# EAGLE design PCB_Draft_1 (EAGLE 9.6.2)
AUTHOR: R. Hall, A. Singh, K.Quizon; BOARD_NAME: ESP32 I2C Exp / M Driver; DOC_NUM: 0; PROJECT_NAME: R8-O7 PCB; REVISION: 4
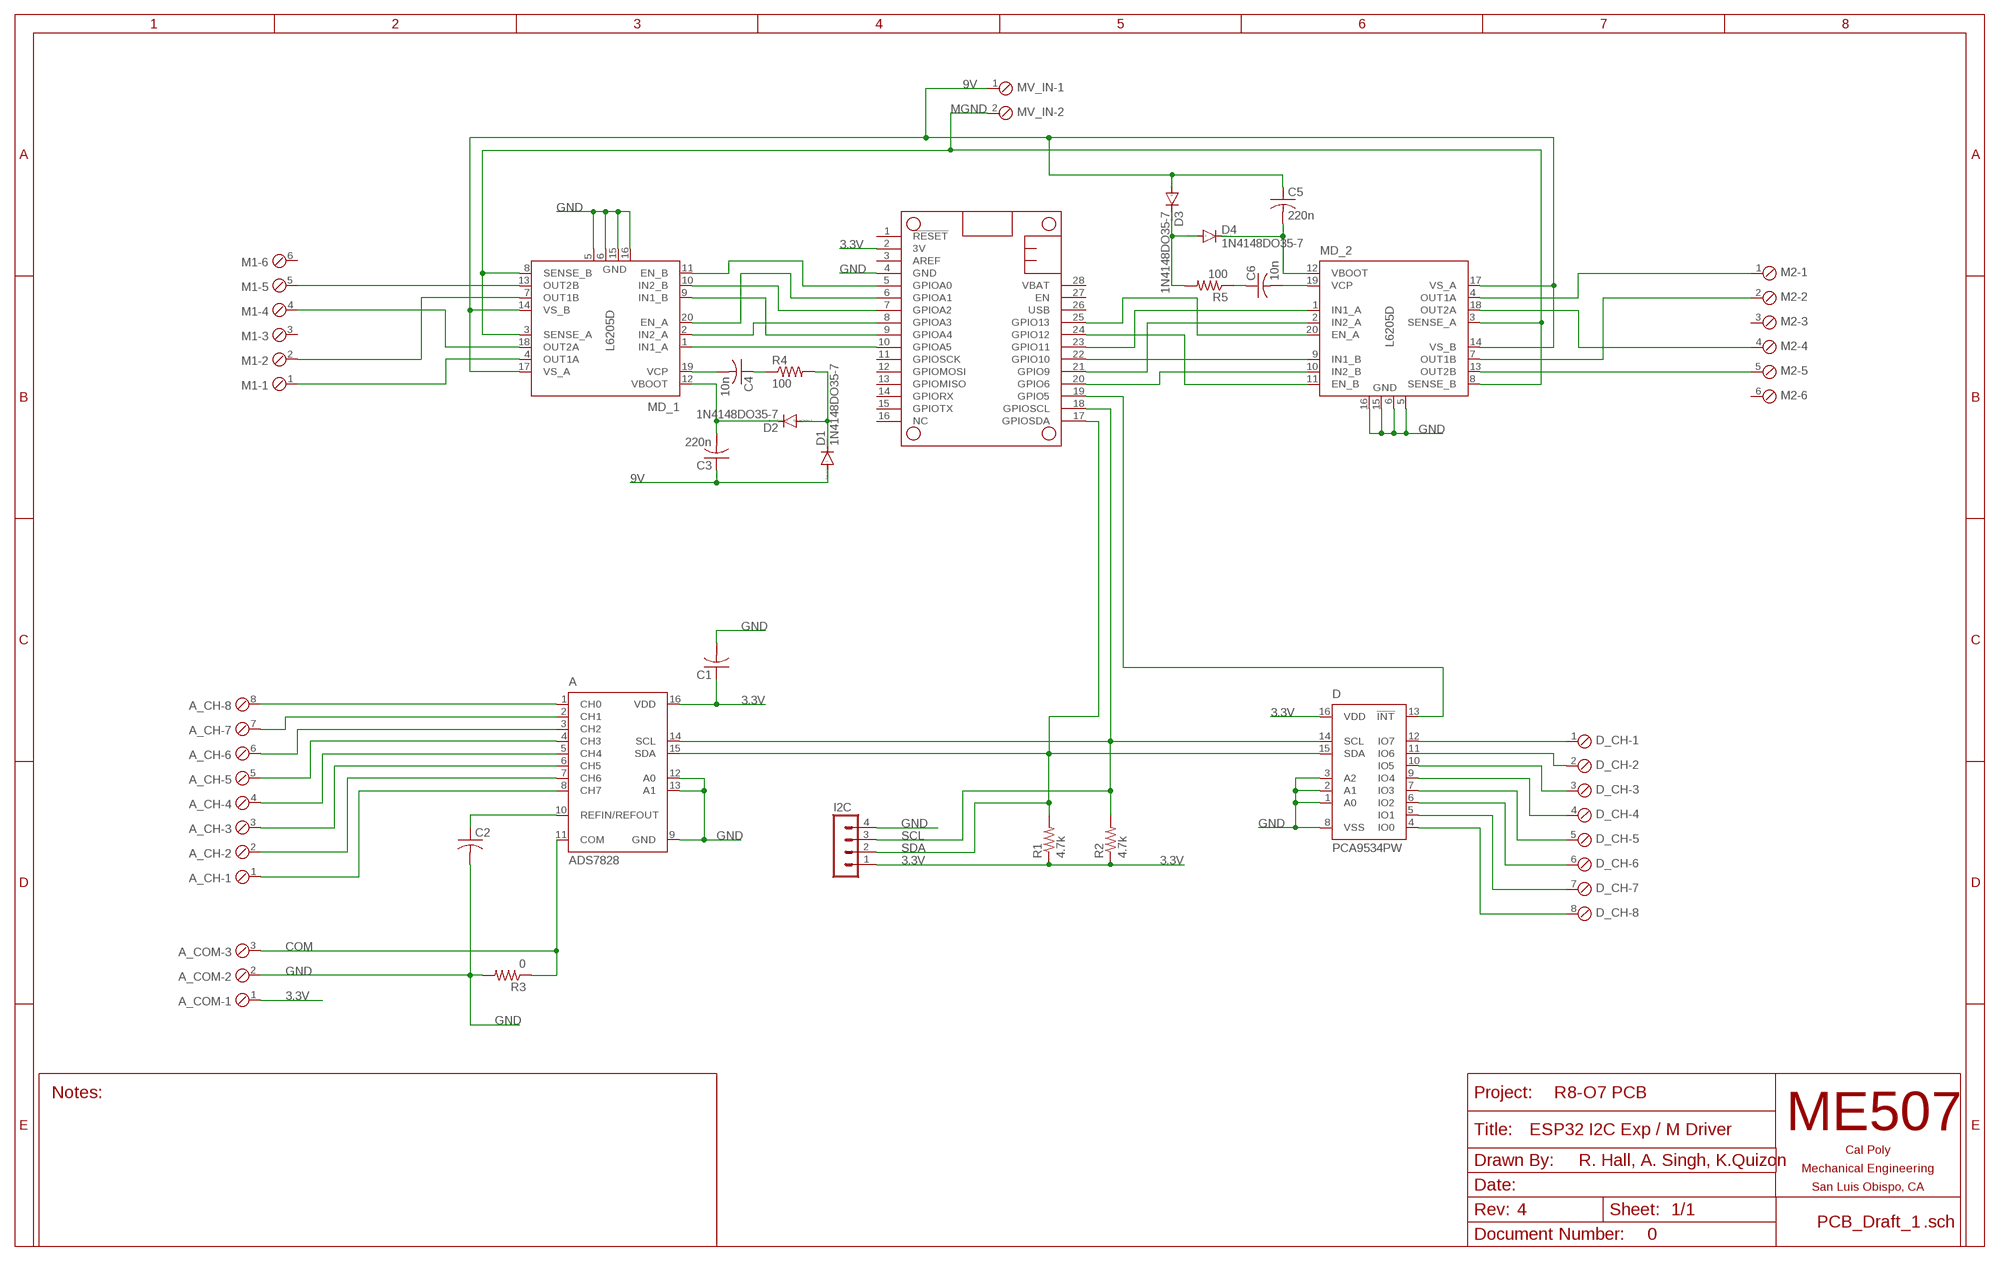
[diagram p0: schematic, sheet 1]

## Parts
A  ADS7828  [TSSOP16-PW]
A_CH  SCREWTERM_8P_254  [8POL254]
A_COM  SCREWTERM_3P_254  [3POL254]
C1  C-USC0805  [C0805]
C2  C-USC0805  [C0805]
C3  220n  C-USC0805  [C0805]
C4  10n  C-USC0805  [C0805]
C5  220n  C-USC0805  [C0805]
C6  10n  C-USC0805  [C0805]
D  PCA9534PW  [TSSOP16]
D1  1N4148DO35-7  [DO35-7]
D2  1N4148DO35-7  [DO35-7]
D3  1N4148DO35-7  [DO35-7]
D4  1N4148DO35-7  [DO35-7]
D_CH  SCREWTERM_8P_254  [8POL254]
FTHRWNG  FEATHERWINGEXTENDED_BOTH_ENDS  [FEATHERWING]
I2C  MA04-1  [MA04-1]
M1  SCREWTERM_6P_254  [6POL254]
M2  SCREWTERM_6P_254  [6POL254]
MD_1  L6205D  [SO20]
MD_2  L6205D  [SO20]
MV_IN  SCREWTERM_2P_254  [2POL254]
R1  4.7k  R-US_M0805  [M0805]
R2  4.7k  R-US_M0805  [M0805]
R3  0  R-US_M0805  [M0805]
R4  100  R-US_M0805  [M0805]
R5  100  R-US_M0805  [M0805]

## Nets
3.3V: A.16(VDD) A_COM.1 C1.1 D.16(VDD) FTHRWNG.2(3V) I2C.1 R1.1 R2.1
9V: C3.1 C5.1 D1.A D3.A MD_1.14(VS_B) MD_1.17(VS_A) MD_2.14(VS_B) MD_2.17(VS_A) MV_IN.1
COM: A.11(COM) A_COM.3 R3.1
GND: A.9(GND) A.12(A0) A.13(A1) A_COM.2 C1.2 C2.2 D.1(A0) D.2(A1) D.3(A2) D.8(VSS) FTHRWNG.4(GND) I2C.4 MD_1.5(GND) MD_1.6(GND) MD_1.15(GND) MD_1.16(GND) MD_2.5(GND) MD_2.6(GND) MD_2.15(GND) MD_2.16(GND) R3.2
MGND: MD_1.3(SENSE_A) MD_1.8(SENSE_B) MD_2.3(SENSE_A) MD_2.8(SENSE_B) MV_IN.2
N$1: D.12(IO7) D_CH.1
N$2: D.11(IO6) D_CH.2
N$3: D.10(IO5) D_CH.3
N$4: D.9(IO4) D_CH.4
N$5: D.7(IO3) D_CH.5
N$6: D.6(IO2) D_CH.6
N$7: D.5(IO1) D_CH.7
N$8: D.4(IO0) D_CH.8
N$9: A.1(CH0) A_CH.8
N$10: A.2(CH1) A_CH.7
N$11: A.3(CH2) A_CH.6
N$12: A.4(CH3) A_CH.5
N$13: A.5(CH4) A_CH.4
N$14: A.6(CH5) A_CH.3
N$15: A.7(CH6) A_CH.2
N$16: A.8(CH7) A_CH.1
N$17: A.10(REFIN/REFOUT) C2.1
N$18: C4.2 MD_1.19(VCP)
N$19: D.13(!INT) FTHRWNG.19(GPIO5)
N$20: M1.1 MD_1.4(OUT1A)
N$21: M1.2 MD_1.7(OUT1B)
N$22: M1.4 MD_1.18(OUT2A)
N$23: M1.5 MD_1.13(OUT2B)
N$24: M2.1 MD_2.4(OUT1A)
N$25: C4.1 R4.1
N$26: M2.2 MD_2.7(OUT1B)
N$27: M2.4 MD_2.18(OUT2A)
N$28: M2.5 MD_2.13(OUT2B)
N$29: FTHRWNG.20(GPIO6) MD_2.10(IN2_B)
N$30: FTHRWNG.22(GPIO10) MD_2.9(IN1_B)
N$31: FTHRWNG.21(GPIO9) MD_2.2(IN2_A)
N$32: FTHRWNG.23(GPIO11) MD_2.1(IN1_A)
N$33: FTHRWNG.10(GPIOA5) MD_1.1(IN1_A)
N$34: FTHRWNG.8(GPIOA3) MD_1.2(IN2_A)
N$35: FTHRWNG.9(GPIOA4) MD_1.9(IN1_B)
N$36: FTHRWNG.7(GPIOA2) MD_1.10(IN2_B)
N$37: FTHRWNG.24(GPIO12) MD_2.11(EN_B)
N$38: FTHRWNG.25(GPIO13) MD_2.20(EN_A)
N$39: FTHRWNG.6(GPIOA1) MD_1.20(EN_A)
N$40: FTHRWNG.5(GPIOA0) MD_1.11(EN_B)
N$41: D1.C D2.A R4.2
N$42: C3.2 D2.C MD_1.12(VBOOT)
N$43: C6.2 MD_2.19(VCP)
N$44: C6.1 R5.1
N$45: D3.C D4.A R5.2
N$46: C5.2 D4.C MD_2.12(VBOOT)
SCL: A.14(SCL) D.14(SCL) FTHRWNG.18(GPIOSCL) I2C.3 R2.2
SDA: A.15(SDA) D.15(SDA) FTHRWNG.17(GPIOSDA) I2C.2 R1.2
Unconnected: FTHRWNG.1(!RESET) FTHRWNG.3(AREF) FTHRWNG.11(GPIOSCK) FTHRWNG.12(GPIOMOSI) FTHRWNG.13(GPIOMISO) FTHRWNG.14(GPIORX) FTHRWNG.15(GPIOTX) FTHRWNG.16(NC) FTHRWNG.26(USB) FTHRWNG.27(EN) FTHRWNG.28(VBAT) M1.3 M1.6 M2.3 M2.6

## Library data of the parts
A = burr-brown:ADS7828: 12-Bit, 8-Channel Sampling ANALOG-TO-DIGITAL CONVERTER with I2C? Interface Source: www.ti.com .. ADS7828.pdf; MF: TEXAS INSTRUMENTS; MPN: ADS7828E/250; OC_FARNELL: 1470338; OC_NEWARK: 74C7158
A_CH D_CH = ME507:SCREWTERM_8P: Screw Terminal Block This part is designed for a screw terminal connector. The 2.54mm (0.100 inch) foorprint can also be used for male or female pin headers such as those on most development boards. One can also solder wires directly into the holes, though this makes modifications or repairs to the system more inconvenient. Larger versions can carry more current.
A_COM = ME507:SCREWTERM_3P: Screw Terminal Block This part is designed for a screw terminal connector. The 2.54mm (0.100 inch) foorprint can also be used for male or female pin headers such as those on most development boards. One can also solder wires directly into the holes, though this makes modifications or repairs to the system more inconvenient. Larger versions can carry more current.
C1-C6 = rcl:C-US: CAPACITOR, American symbol; SPICEPREFIX: C
D = micro-philips:PCA9534: 8-bit I2C-bus and SMBus low power I/O port with interrupt Source: www.nxp.com .. PCA9534_3.pdf; MPN: PCA9534PW; OC_FARNELL: 1408285; OC_NEWARK: 18M7516
D1-D4 = diode:1N4148: DIODE high speed (Philips)
FTHRWNG = ME507:FEATHERWING: AdaFruitTM Feather Wing A modified version of a Featherwing, the add-on board for an AdaFruit(tm) Feather development board. There is a standard size version which is the same size as the Feather board on which the microcontroller hangs out. There is also an extended version, with each and longer by a quarter inch to allow for connectors such as screw terminals which aren't hidden under another board if this wing isn't on the top of the board stack. The pins are named in a generic fashion; these names do not necessarily correspond to Arduino or Python pin numbers. The designer must refer to the pinout diagram for each specific Feather board to find the functions of each pin.
I2C = con-lstb:MA04-1: PIN HEADER; OC_FARNELL: unknown; OC_NEWARK: unknown
M1 M2 = ME507:SCREWTERM_6P: Screw Terminal Block This part is designed for a screw terminal connector. The 2.54mm (0.100 inch) foorprint can also be used for male or female pin headers such as those on most development boards. One can also solder wires directly into the holes, though this makes modifications or repairs to the system more inconvenient. Larger versions can carry more current.
MD_1 MD_2 = st-microelectronics:L6205: DUAL DMOS FULL BRIDGE MOTOR DRIVER; MPN: L6205D; OC_FARNELL: unknown; OC_NEWARK: 37M3487
MV_IN = ME507:SCREWTERM_2P: Screw Terminal Block This part is designed for a screw terminal connector. The 2.54mm (0.100 inch) foorprint can also be used for male or female pin headers such as those on most development boards. One can also solder wires directly into the holes, though this makes modifications or repairs to the system more inconvenient. Larger versions can carry more current.
R1-R5 = rcl:R-US_: RESISTOR, American symbol; SPICEPREFIX: R

## Board
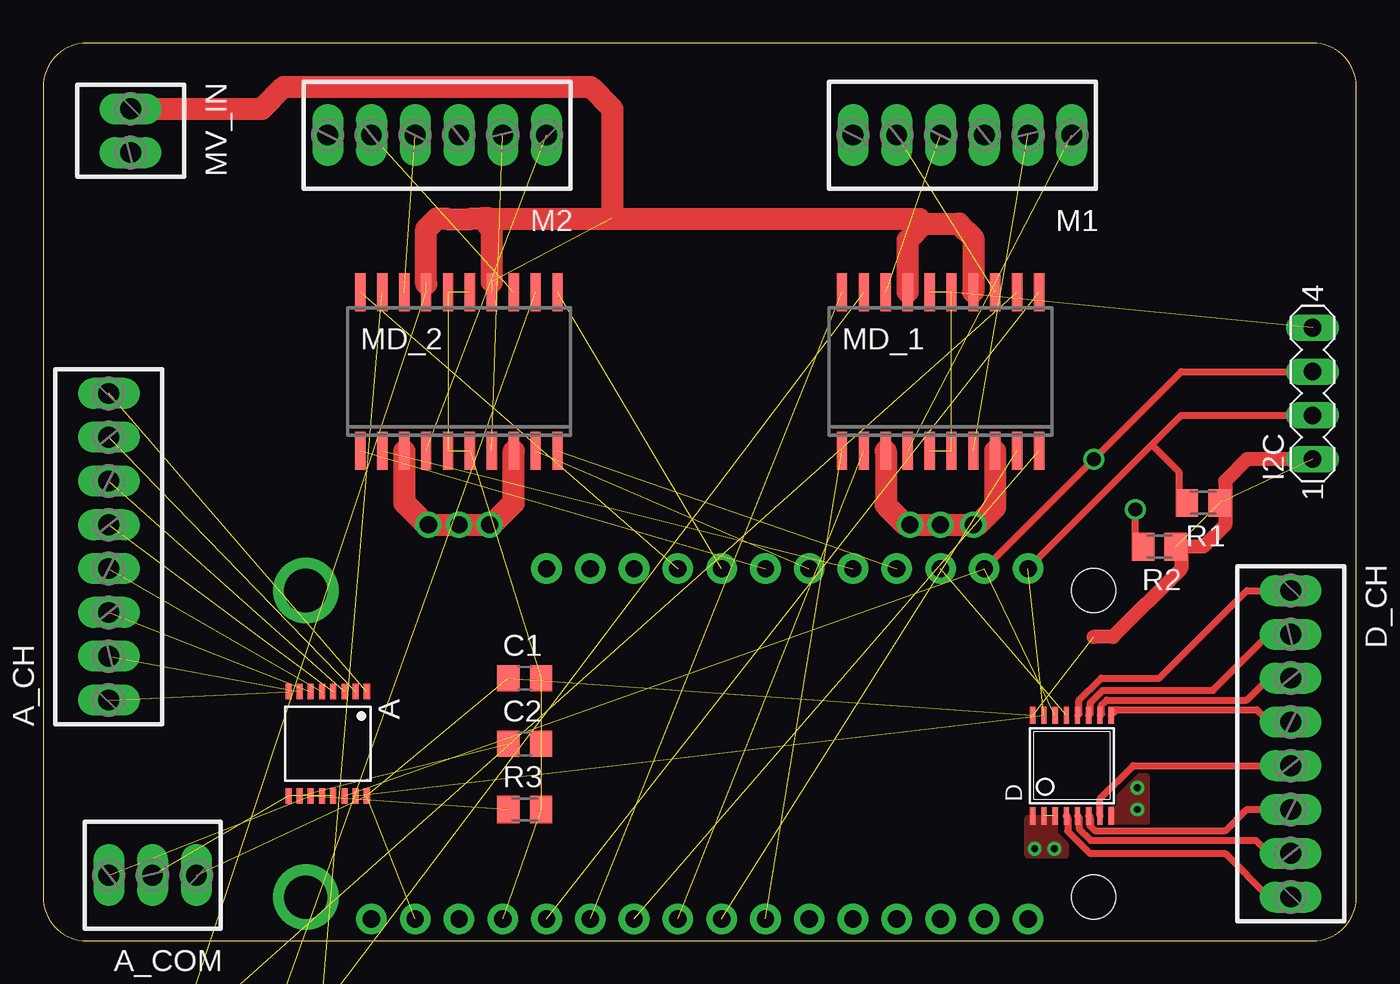
[diagram p1: board, top side]
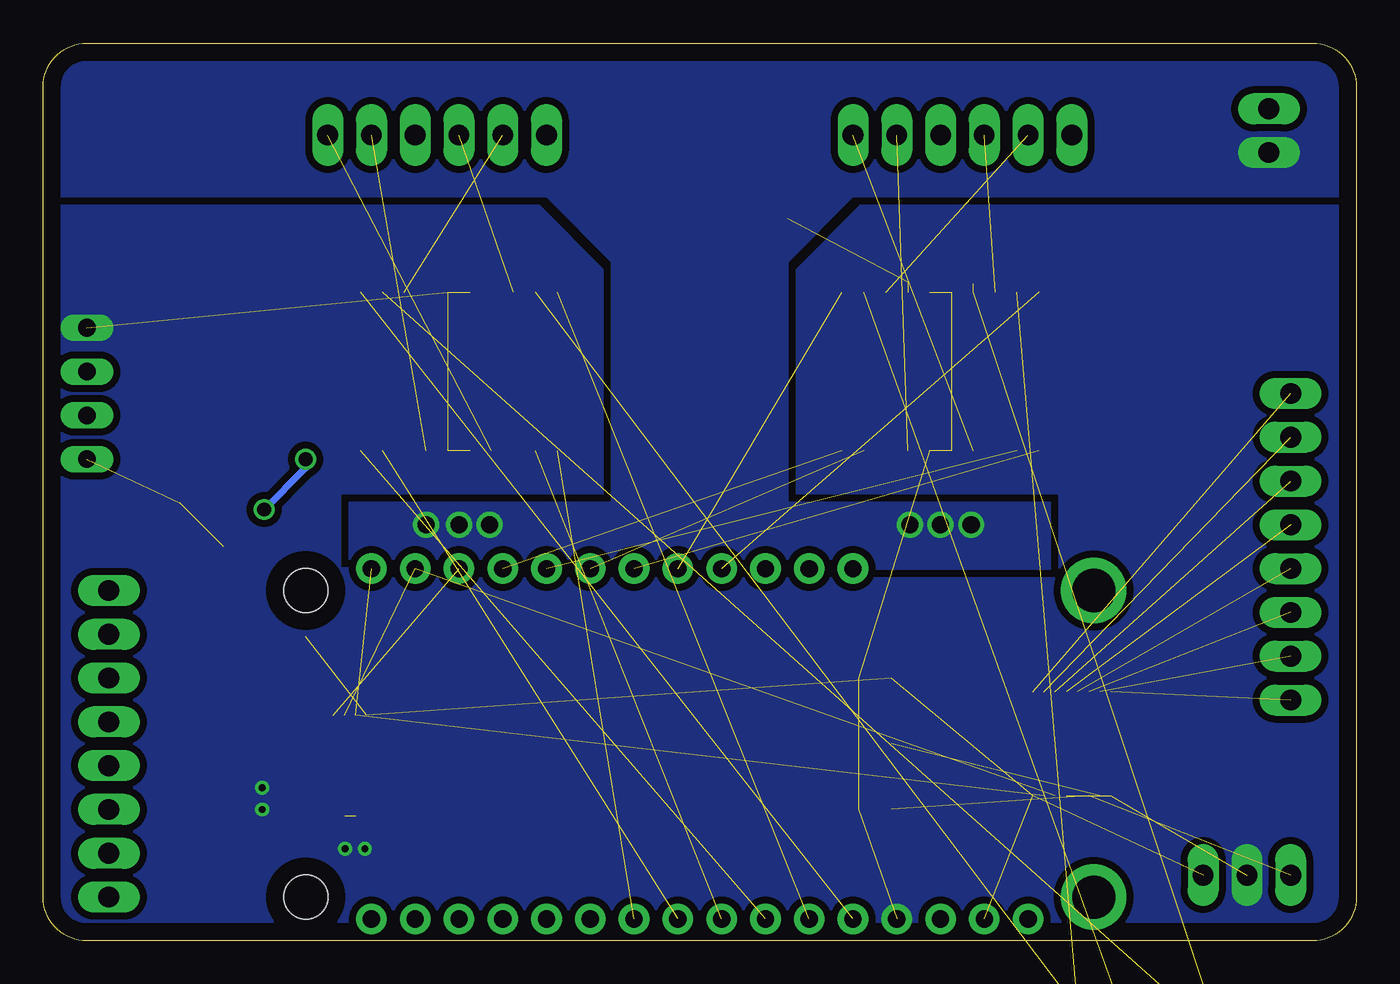
[diagram p2: board, bottom side, seen from below]

Size 76.2 x 52.07 mm. Coordinates in mm from the lower left corner, seen from the top.
Copper layers (1*16): Top 0.035mm / dielectric 1.5mm / Bottom 0.035mm
Design rules "default": minimum track width 6mil, minimum drill 0.35mm, track to track 6mil, track to pad 6mil, pad to pad 6mil, via to via 6mil, smd to smd 6mil, copper to edge 40mil, drill to drill 6mil, minimum pad ring 10mil, minimum via ring 8mil, stop-mask expansion 4mil, vias tented up to drill 0mil, thermal gap 10mil

### Footprints (pad centres in the part's own frame; a part is rotated, then mirrored left to right if it is on the bottom)
TSSOP16-PW = smd 0.35 x 0.9: 1 -2.275,-3.025; 2 -1.625,-3.025; 3 -0.975,-3.025; 4 -0.325,-3.025; 5 0.325,-3.025; 6 0.975,-3.025; 7 1.625,-3.025; 8 2.275,-3.025; 9 2.275,3.025; 10 1.625,3.025; 11 0.975,3.025; 12 0.325,3.025; 13 -0.325,3.025; 14 -0.975,3.025; 15 -1.625,3.025; 16 -2.275,3.025
8POL254 = drill 1.2 long: 1 -8.89,0; 2 -6.35,0; 3 -3.81,0; 4 -1.27,0; 5 1.27,0; 6 3.81,0; 7 6.35,0; 8 8.89,0
3POL254 = drill 1.2 long: 1 -2.54,0; 2 0,0; 3 2.54,0
C0805 = smd 1.3 x 1.5: 1 -0.95,0; 2 0.95,0
TSSOP16 = smd 0.305 x 0.991: 1 -2.275,-2.918; 2 -1.625,-2.918; 3 -0.975,-2.918; 4 -0.325,-2.918; 5 0.325,-2.918; 6 0.975,-2.918; 7 1.625,-2.918; 8 2.275,-2.918; 9 2.275,2.918; 10 1.625,2.918; 11 0.975,2.918; 12 0.325,2.918; 13 -0.325,2.918; 14 -0.975,2.918; 15 -1.625,2.918; 16 -2.275,2.918
DO35-7 = drill 0.813 long: A 3.81,0; C -3.81,0
FEATHERWING = drill 1 pad 1.778: 1 6.35,1.27; 2 8.89,1.27; 3 11.43,1.27; 4 13.97,1.27; 5 16.51,1.27; 6 19.05,1.27; 7 21.59,1.27; 8 24.13,1.27; 9 26.67,1.27; 10 29.21,1.27; 11 31.75,1.27; 12 34.29,1.27; 13 36.83,1.27; 14 39.37,1.27; 15 41.91,1.27; 16 44.45,1.27; 17 44.45,21.59; 18 41.91,21.59; 19 39.37,21.59; 20 36.83,21.59; 21 34.29,21.59; 22 31.75,21.59; 23 29.21,21.59; 24 26.67,21.59; 25 24.13,21.59; 26 21.59,21.59; 27 19.05,21.59; 28 16.51,21.59 | drill 2.5 pad 3.81: P$1 2.54,20.32; P$2 2.54,2.54 | hole 2.54: 48.26,20.32; 48.26,2.54
MA04-1 = drill 1.016 long: 1 -3.81,0; 2 -1.27,0; 3 1.27,0; 4 3.81,0
6POL254 = drill 1.2 pad 1.778 long: 1 -6.35,0; 2 -3.81,0; 3 -1.27,0; 4 1.27,0; 5 3.81,0; 6 6.35,0
SO20 = smd 0.6 x 2.2: 1 -5.715,-4.6; 2 -4.445,-4.6; 3 -3.175,-4.6; 4 -1.905,-4.6; 5 -0.635,-4.6; 6 0.635,-4.6; 7 1.905,-4.6; 8 3.175,-4.6; 9 4.445,-4.6; 10 5.715,-4.6; 11 5.715,4.6; 12 4.445,4.6; 13 3.175,4.6; 14 1.905,4.6; 15 0.635,4.6; 16 -0.635,4.6; 17 -1.905,4.6; 18 -3.175,4.6; 19 -4.445,4.6; 20 -5.715,4.6
2POL254 = drill 1.2 long: 1 -1.27,0; 2 1.27,0
M0805 = smd 1.3 x 1.6: 1 -0.95,0; 2 0.95,0

### Placement (x,y rotation side)
A  16.51,11.43 180 top
A_CH  3.81,22.86 90 top
A_COM  6.35,3.81 180 top
C1  27.94,15.24 0 top
C2  27.94,11.43 0 top
C3  0,-19.05 0 top  (outside the outline)
C4  0,-24.13 0 top  (outside the outline)
C5  0,-48.26 0 top  (outside the outline)
C6  11.43,-48.26 0 top  (outside the outline)
D  59.69,10.16 0 top
D1  3.81,-6.35 0 top  (outside the outline)
D2  3.81,-12.7 0 top  (outside the outline)
D3  3.81,-35.56 0 top  (outside the outline)
D4  3.81,-41.91 0 top  (outside the outline)
D_CH  72.39,11.43 270 top
FTHRWNG  12.7,0 0 top
I2C  73.66,31.75 90 top
M1  53.34,46.74 180 top
M2  22.86,46.74 180 top
MD_1  52.07,33.02 0 top
MD_2  24.13,33.02 0 top
MV_IN  5.08,46.99 270 top
R1  67.31,25.4 180 top
R2  64.77,22.86 180 top
R3  27.94,7.62 0 top
R4  0,-29.21 0 top  (outside the outline)
R5  6.35,-48.26 0 top  (outside the outline)

### Tracks (layer width: path | path; a pad name or v marks a point on that pad's centre or on a via)
3.3V  (7 unrouted)
  Top 0.813: 60.96,17.63 62.08,17.63 66.04,21.59 66.04,22.86 67.31,22.86 68.58,24.13 68.58,26.67 69.85,27.94 I2C.1
9V  (7 unrouted)
  Top 1.27: MV_IN.1 12.7,48.26 13.97,49.53 31.75,49.53 33.02,48.26 33.02,41.91 | 22.23,38.1 22.23,41.27 22.86,41.91 23.38,41.91 23.43,41.86 24.83,41.86 24.88,41.91 25.4,41.91 | 25.4,41.91 26.04,41.27 26.04,38.23 | MD_1.17 50.16,40.64 51.12,41.59 | 51.12,41.59 53.15,41.59 53.98,40.77 MD_1.14 | 25.4,41.91 25.92,41.91 25.97,41.86 50.85,41.86 51.12,41.59
COM  (2 unrouted)
GND  (via drill 0.4)  (15 unrouted)
  other vias: 63.5,8.89 63.5,7.62 58.67,5.33 57.53,5.33
  pour Bottom (isolate 0.406, rank 6, no thermals): 0,52.07 0,0 76.2,0 76.2,52.07
  pour Top (no thermals): 58.67,7.11 58.67,6.22 59.31,5.59 59.31,4.95 57.15,4.95 57.15,7.11
  pour Top (no thermals): 61.98,7.62 61.98,6.86 64.01,6.86 64.01,9.53 63.63,9.53 62.48,8.38 62.48,7.62
MGND  (via drill 1)
  Top 1.27: MD_2.3 20.95,25.4 22.23,24.13 v22.35,24.13 v25.91,24.13 26.04,24.13 27.3,25.4 MD_2.8 | MD_1.3 48.9,25.27 50.04,24.13 v52.07,24.13 v53.98,24.13 54.23,24.13 55.24,25.15 MD_1.8
  other vias: 24.13,24.13 50.29,24.13
  pour Bottom (isolate 0.406, no thermals): 0,52.07 0,43.18 29.21,43.18 33.02,39.37 33.02,25.4 17.78,25.4 17.78,21.59 58.42,21.59 58.42,25.4 43.18,25.4 43.18,39.37 46.99,43.18 76.2,43.18 76.2,52.07
N$1
  Top 0.406: D.12 60.11,13.17 60.11,13.95 61.4,15.24 64.77,15.24 69.85,20.32 D_CH.1
N$2
  Top 0.406: D.11 60.76,13.17 60.76,13.81 61.48,14.53 67.87,14.53 71.12,17.78 D_CH.2
N$3
  Top 0.406: D.10 61.41,13.17 61.41,13.67 61.71,13.97 69.85,13.97 71.12,15.24 D_CH.3
N$4
  Top 0.406: D.9 62.3,13.41 70.41,13.41 71.12,12.7 D_CH.4
N$5
  Top 0.406: D.7 61.31,8.23 63.25,10.16 D_CH.5
N$6
  Top 0.406: D.6 60.76,7.15 60.76,6.65 61.02,6.39 68.62,6.39 69.85,7.62 D_CH.6
N$7
  Top 0.406: D.5 60.11,7.15 60.11,6.51 60.78,5.83 70.37,5.83 71.12,5.08 D_CH.7
N$8
  Top 0.406: D.4 59.46,7.15 59.46,6.37 60.75,5.08 68.58,5.08 71.12,2.54 D_CH.8
N$9  (1 unrouted)
N$10  (1 unrouted)
N$11  (1 unrouted)
N$12  (1 unrouted)
N$13  (1 unrouted)
N$14  (1 unrouted)
N$15  (1 unrouted)
N$16  (1 unrouted)
N$17  (1 unrouted)
N$18  (1 unrouted)
N$19  (1 unrouted)
N$20  (1 unrouted)
N$21  (1 unrouted)
N$22  (1 unrouted)
N$23  (1 unrouted)
N$24  (1 unrouted)
N$25  (1 unrouted)
N$26  (1 unrouted)
N$27  (1 unrouted)
N$28  (1 unrouted)
N$29  (1 unrouted)
N$30  (1 unrouted)
N$31  (1 unrouted)
N$32  (1 unrouted)
N$33  (1 unrouted)
N$34  (1 unrouted)
N$35  (1 unrouted)
N$36  (1 unrouted)
N$37  (1 unrouted)
N$38  (1 unrouted)
N$39  (1 unrouted)
N$40  (1 unrouted)
N$41  (2 unrouted)
N$42  (2 unrouted)
N$43  (1 unrouted)
N$44  (1 unrouted)
N$45  (2 unrouted)
N$46  (2 unrouted)
SCL  (via drill 0.8)  (2 unrouted)
  Top 0.406: FTHRWNG.18 v60.96,27.94 66.04,33.02 I2C.3 | R2.2 63.37,23.31 v63.37,25.02
  Bottom 0.406: v63.37,25.02 60.96,27.43 v60.96,27.94
SDA  (2 unrouted)
  Top 0.406: FTHRWNG.17 64.33,28.77 | 64.33,28.77 66.04,30.48 I2C.2 | R1.2 65.91,25.85 65.91,27.18 64.33,28.77